# Altium project MY26 HV Inverter Logic Board.PrjPcb (part 1 of 3)
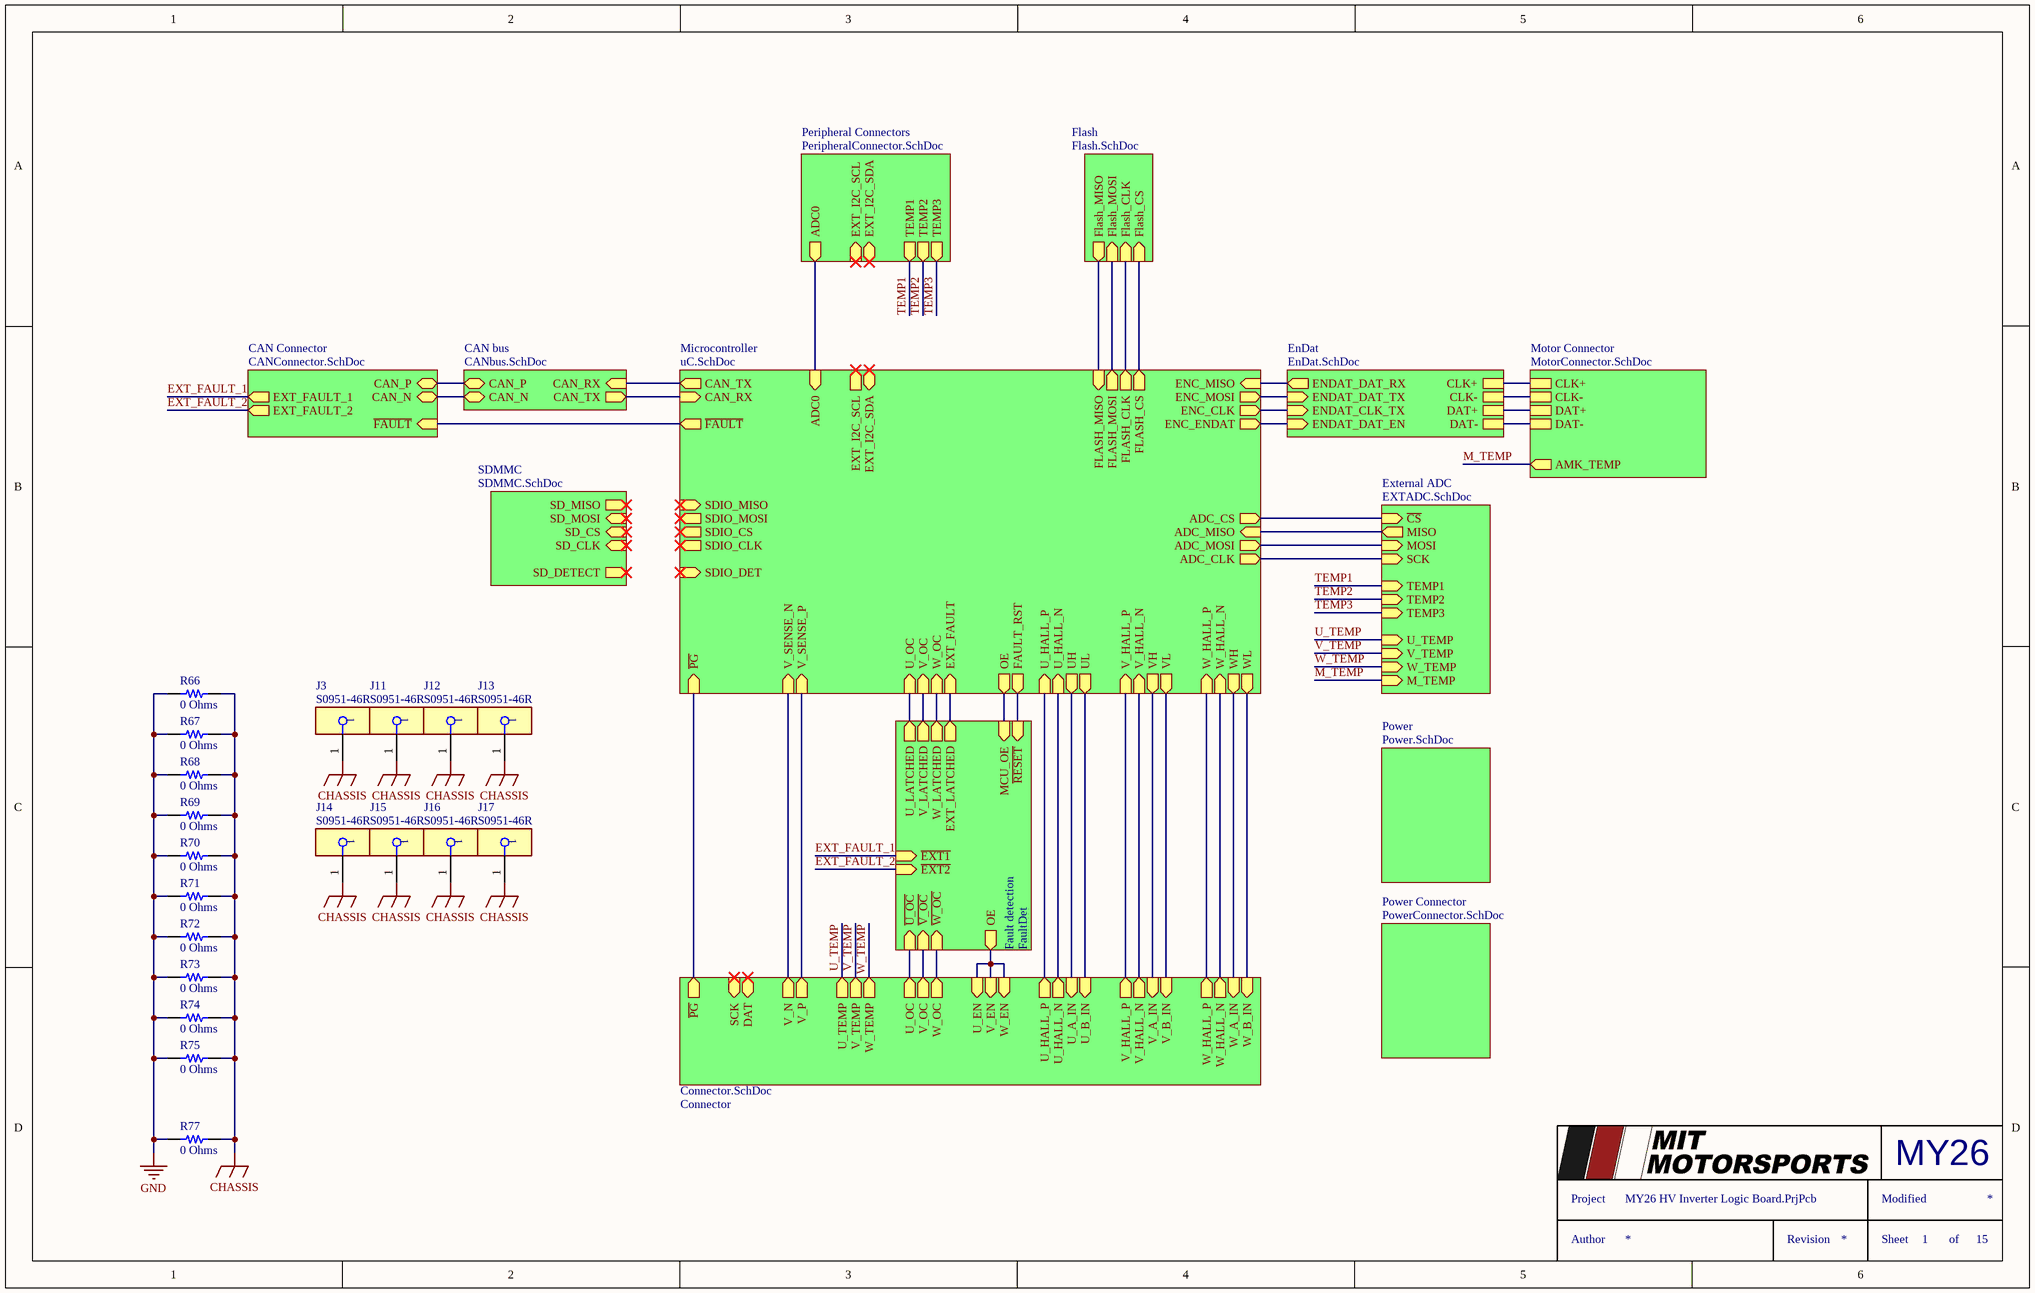
[diagram p0: Schematic.SchDoc]
Model: 26
15 sheets, 228 parts. Net scope: hierarchical (ports join the sheet entries above them; power ports are global).
Board file: PCB.PcbDoc
Sheets:
  Schematic.SchDoc
    CAN bus = CANbus.SchDoc
    Microcontroller = uC.SchDoc
      JTAG = JTAG.SchDoc
    Connector = Connector.SchDoc
    SDMMC = SDMMC.SchDoc
    Power = Power.SchDoc
    Power Connector = PowerConnector.SchDoc
    CAN Connector = CANConnector.SchDoc
    Motor Connector = MotorConnector.SchDoc
    Peripheral Connectors = PeripheralConnector.SchDoc
    External ADC = EXTADC.SchDoc
    EnDat = EnDat.SchDoc
    Fault detection = FaultDet.SchDoc
    Flash = Flash.SchDoc

## Sheet Schematic.SchDoc
size B; SheetNumber: 1; SheetTotal: 15

### Parts
(Parts that share a designator on the sheet are numbered #1, #2 ... from top to bottom, then left to right.)
J3#1  S0951-46R  [FP-S0951-46R-MFG]
J11  S0951-46R  [FP-S0951-46R-MFG]
J12  S0951-46R  [FP-S0951-46R-MFG]
J13  S0951-46R  [FP-S0951-46R-MFG]
J14  S0951-46R  [FP-S0951-46R-MFG]
J15  S0951-46R  [FP-S0951-46R-MFG]
J16  S0951-46R  [FP-S0951-46R-MFG]
J17  S0951-46R  [FP-S0951-46R-MFG]
R66  0 Ohms  [RES 0402_1005]
R67  0 Ohms  [RES 0402_1005]
R68  0 Ohms  [RES 0402_1005]
R69  0 Ohms  [RES 0402_1005]
R70  0 Ohms  [RES 0402_1005]
R71  0 Ohms  [RES 0402_1005]
R72  0 Ohms  [RES 0402_1005]
R73  0 Ohms  [RES 0402_1005]
R74  0 Ohms  [RES 0402_1005]
R75  0 Ohms  [RES 0402_1005]
R77  0 Ohms  [RES 0402_1005]

### Sub-sheets
CAN bus = CANbus.SchDoc: CAN_N (bidir), CAN_P (bidir), CAN_RX (in), CAN_TX (out)
CAN Connector = CANConnector.SchDoc: ~{FAULT} (in), CAN_P (bidir), CAN_N (bidir), EXT_FAULT_1 (out), EXT_FAULT_2 (out)
Connector = Connector.SchDoc: W_HALL_N (out), W_HALL_P (out), W_A_IN (in), W_B_IN (in), V_A_IN (in), V_B_IN (in), V_HALL_N (out), V_HALL_P (out), U_HALL_P (out), U_HALL_N (out), U_B_IN (in), U_A_IN (in), U_OC (out), V_OC (out), W_OC (out), U_TEMP (out), V_TEMP (out), W_TEMP (out), V_N (out), V_P (out), SCK (in), DAT (bidir), ~{PG} (out), U_EN (in), V_EN (in), W_EN (in)
EnDat = EnDat.SchDoc: ENDAT_DAT_RX (out), ENDAT_DAT_EN (in), ENDAT_DAT_TX (in), ENDAT_CLK_TX (in), CLK-, CLK+, DAT+, DAT-
External ADC = EXTADC.SchDoc: ~{CS} (in), MISO (out), MOSI (in), SCK (in), TEMP1 (in), TEMP2 (in), TEMP3 (in), U_TEMP (in), V_TEMP (in), W_TEMP (in), M_TEMP (in)
Fault detection = FaultDet: MCU_OE (in), OE (out), EXT_LATCHED (out), U_LATCHED (out), V_LATCHED (out), W_LATCHED (out), ~{W_OC} (in), ~{V_OC} (in), ~{U_OC} (in), ~{RESET} (in), ~{EXT1} (in), ~{EXT2} (in)
Flash = Flash.SchDoc: Flash_CS (in), Flash_MISO (out), Flash_CLK (in), Flash_MOSI (in)
Microcontroller = uC.SchDoc: CAN_TX (out), CAN_RX (in), ~{FAULT} (out), SDIO_MISO (in), SDIO_MOSI (out), SDIO_CS (out), SDIO_CLK (out), UH (out), UL (out), U_HALL_P (in), U_HALL_N (in), WH (out), WL (out), W_HALL_P (in), W_HALL_N (in), VH (out), VL (out), V_HALL_P (in), V_HALL_N (in), U_OC (in), V_OC (in), W_OC (in), V_SENSE_N (in), V_SENSE_P (in), ~{PG} (in), EXT_I2C_SCL (out), EXT_I2C_SDA (bidir), ADC_MOSI (out), ADC_MISO (in), ADC_CLK (out), ADC_CS (out), OE (out), ENC_MISO (in), ENC_MOSI (out), ENC_CLK (out), ENC_ENDAT (out), EXT_FAULT (in), FAULT_RST (out), SDIO_DET (in), FLASH_MISO (in), FLASH_MOSI (out), FLASH_CLK (out), FLASH_CS (out), ADC0 (in)
Motor Connector = MotorConnector.SchDoc: AMK_TEMP (out), CLK+, CLK-, DAT+, DAT-
Peripheral Connectors = PeripheralConnector.SchDoc: ADC0 (out), TEMP1 (out), TEMP2 (out), TEMP3 (out), EXT_I2C_SCL (in), EXT_I2C_SDA (bidir)
Power = Power.SchDoc: no entries
Power Connector = PowerConnector.SchDoc: no entries
SDMMC = SDMMC.SchDoc: SD_DETECT (out), SD_MISO (out), SD_CS (in), SD_MOSI (in), SD_CLK (in)

### Nets
CHASSIS: J3#1.1 J11.1 J12.1 J13.1 J14.1 J15.1 J16.1 J17.1 R66.2 R67.2 R68.2 R69.2 R70.2 R71.2 R72.2 R73.2 R74.2 R75.2 R77.2
GND: R66.1 R67.1 R68.1 R69.1 R70.1 R71.1 R72.1 R73.1 R74.1 R75.1 R77.1 ; sheet Connector/SCK, sheet Connector/DAT
ADC0: sheet Microcontroller/ADC0, sheet Peripheral Connectors/ADC0
ADC_CLK: sheet Microcontroller/ADC_CLK, sheet External ADC/SCK
ADC_CS: sheet Microcontroller/ADC_CS, sheet External ADC/~{CS}
ADC_MISO: sheet Microcontroller/ADC_MISO, sheet External ADC/MISO
ADC_MOSI: sheet Microcontroller/ADC_MOSI, sheet External ADC/MOSI
CAN_N: sheet CAN bus/CAN_N, sheet CAN Connector/CAN_N
CAN_P: sheet CAN bus/CAN_P, sheet CAN Connector/CAN_P
CAN_RX: sheet CAN bus/CAN_TX, sheet Microcontroller/CAN_RX
CAN_TX: sheet CAN bus/CAN_RX, sheet Microcontroller/CAN_TX
CLK+: sheet Motor Connector/CLK+, sheet EnDat/CLK+
CLK-: sheet Motor Connector/CLK-, sheet EnDat/CLK-
DAT+: sheet Motor Connector/DAT+, sheet EnDat/DAT+
DAT-: sheet Motor Connector/DAT-, sheet EnDat/DAT-
ENC_CLK: sheet Microcontroller/ENC_CLK, sheet EnDat/ENDAT_CLK_TX
ENC_ENDAT: sheet Microcontroller/ENC_ENDAT, sheet EnDat/ENDAT_DAT_EN
ENC_MISO: sheet Microcontroller/ENC_MISO, sheet EnDat/ENDAT_DAT_RX
ENC_MOSI: sheet Microcontroller/ENC_MOSI, sheet EnDat/ENDAT_DAT_TX
EXT_FAULT: sheet Microcontroller/EXT_FAULT, sheet Fault detection/EXT_LATCHED
EXT_FAULT_1: sheet CAN Connector/EXT_FAULT_1, sheet Fault detection/~{EXT1}
EXT_FAULT_2: sheet CAN Connector/EXT_FAULT_2, sheet Fault detection/~{EXT2}
~{FAULT}: sheet Microcontroller/~{FAULT}, sheet CAN Connector/~{FAULT}
FAULT_RST: sheet Microcontroller/FAULT_RST, sheet Fault detection/~{RESET}
FLASH_CLK: sheet Microcontroller/FLASH_CLK, sheet Flash/Flash_CLK
FLASH_CS: sheet Microcontroller/FLASH_CS, sheet Flash/Flash_CS
FLASH_MISO: sheet Microcontroller/FLASH_MISO, sheet Flash/Flash_MISO
FLASH_MOSI: sheet Microcontroller/FLASH_MOSI, sheet Flash/Flash_MOSI
M_TEMP: sheet Motor Connector/AMK_TEMP, sheet External ADC/M_TEMP
OE: sheet Microcontroller/OE, sheet Fault detection/MCU_OE
~{PG}: sheet Microcontroller/~{PG}, sheet Connector/~{PG}
TEMP1: sheet Peripheral Connectors/TEMP1, sheet External ADC/TEMP1
TEMP2: sheet Peripheral Connectors/TEMP2, sheet External ADC/TEMP2
TEMP3: sheet Peripheral Connectors/TEMP3, sheet External ADC/TEMP3
U_A_IN: sheet Microcontroller/UH, sheet Connector/U_A_IN
U_B_IN: sheet Microcontroller/UL, sheet Connector/U_B_IN
U_EN: sheet Connector/U_EN, sheet Connector/V_EN, sheet Connector/W_EN, sheet Fault detection/OE
U_HALL_N: sheet Microcontroller/U_HALL_N, sheet Connector/U_HALL_N
U_HALL_P: sheet Microcontroller/U_HALL_P, sheet Connector/U_HALL_P
U_LATCHED: sheet Microcontroller/U_OC, sheet Fault detection/U_LATCHED
U_OC: sheet Connector/U_OC, sheet Fault detection/~{U_OC}
U_TEMP: sheet Connector/U_TEMP, sheet External ADC/U_TEMP
V_A_IN: sheet Microcontroller/VH, sheet Connector/V_A_IN
V_B_IN: sheet Microcontroller/VL, sheet Connector/V_B_IN
V_HALL_N: sheet Microcontroller/V_HALL_N, sheet Connector/V_HALL_N
V_HALL_P: sheet Microcontroller/V_HALL_P, sheet Connector/V_HALL_P
V_LATCHED: sheet Microcontroller/V_OC, sheet Fault detection/V_LATCHED
V_OC: sheet Connector/V_OC, sheet Fault detection/~{V_OC}
V_SENSE_N: sheet Microcontroller/V_SENSE_N, sheet Connector/V_N
V_SENSE_P: sheet Microcontroller/V_SENSE_P, sheet Connector/V_P
V_TEMP: sheet Connector/V_TEMP, sheet External ADC/V_TEMP
W_A_IN: sheet Microcontroller/WH, sheet Connector/W_A_IN
W_B_IN: sheet Microcontroller/WL, sheet Connector/W_B_IN
W_HALL_N: sheet Microcontroller/W_HALL_N, sheet Connector/W_HALL_N
W_HALL_P: sheet Microcontroller/W_HALL_P, sheet Connector/W_HALL_P
W_LATCHED: sheet Microcontroller/W_OC, sheet Fault detection/W_LATCHED
W_OC: sheet Connector/W_OC, sheet Fault detection/~{W_OC}
W_TEMP: sheet Connector/W_TEMP, sheet External ADC/W_TEMP

### Notes on the sheet
- MY
- Project
- Author
- Revision
- Sheet
- Modified
- of

### Library data of the parts
J3#1 J11-J17 = CMP-15817-000012-1: RFI SHIELD CLIP MINI TIN SMD; Width: 0.04inch; Min Operating Temperature: -40°C; Max Operating Temperature: 185°C; Thickness: 0.051inch; REACH SVHC: No SVHC; Length: 0.155inch
R66-R75 R77 = RCC04020000Z0ED: RCC0402 0R0 ET7 E3; Manufacturer: Vishay Dale; Power (Watts): 0.125W, 1/8W; Tolerance: Jumper; Part Number: RCC04020000Z0ED; Value: 0 Ohms; ComponentLink1Description: Datasheet; ComponentLink1URL: https://www.vishay.com/docs/20066/rcce3.pdf; ComponentLink2Description: DigiKey Link; ComponentLink2URL: https://www.digikey.com/en/products/detail/vishay-dale/RCC04020000Z0ED/12084253; Composition: Thick Film; Device Package: 0402 (1005 Metric); Features: Automotive AEC-Q200; Height - Seated (Max): 0.016" (0.40mm); LastUpdated: 2/9/2024 8:28:54 PM; Lifecycle Status: Active; Minimum Order: 1; Number of Terminations: 2; Operating Temperature: -55°C ~ 155°C; Package / Case: 0402 (1005 Metric); Packaging: TapeAndReel; PartId: 66958; Part Status: Active; Price: 0.01; Ratings: AEC-Q200; Resistance: 0 Ohms; Series: RCC e3; Size / Dimension: 0.039" L x 0.020" W (1.00mm x 0.50mm); Supplier 1: DigiKey; Supplier Part Number 1: 541-RCC04020000Z0EDCT-ND; Supplier Device Package: 0402

## Sheet CANbus.SchDoc
size A; SheetNumber: 3; SheetTotal: 15
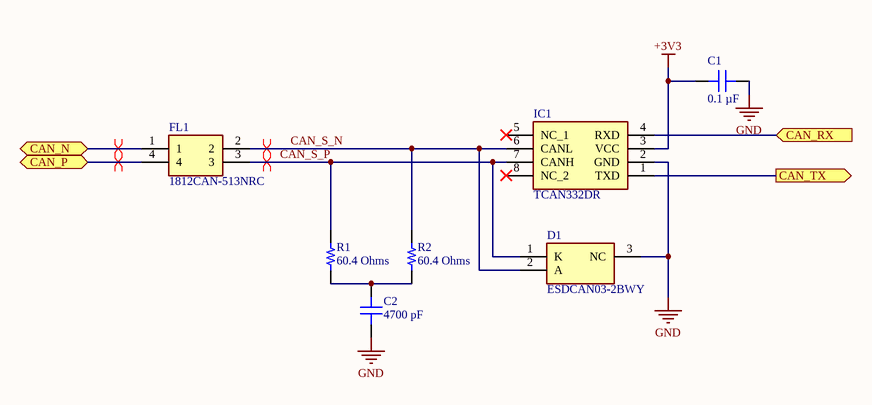
[diagram p1: CANbus.SchDoc]

### Parts
C1  0.1 µF  [CAP 0402_1005]
C2  4700 pF  [CAP 0402_1005]
D1  ESDCAN03-2BWY  [SOT65P210X110-3N]
FL1  1812CAN-513NRC  [1812CAN513NRC]
IC1  TCAN332DR  [SOIC127P600X175-8N]
R1  60.4 Ohms  [RES 0402_1005]
R2  60.4 Ohms  [RES 0402_1005]

### Ports
CAN_N (bidir), CAN_P (bidir), CAN_RX (in), CAN_TX (out)

### Nets
+3V3: C1.1 IC1.3(VCC)
GND: C1.2 C2.1 D1.3(NC) IC1.2(GND)
CAN_N: FL1.1 ; port CAN_N
CAN_P: FL1.4 ; port CAN_P
CAN_RX: IC1.1(TXD) ; port CAN_TX
CAN_S_N: D1.2(A) FL1.2 IC1.6(CANL) R2.1  [project net CAN_S_N_3]
CAN_S_P: D1.1(K) FL1.3 IC1.7(CANH) R1.1  [project net CAN_S_P_3]
CAN_TX: IC1.4(RXD) ; port CAN_RX
NetC2_2: C2.2 R1.2 R2.2

Not connected (* = marked no-connect by the designer): IC1 5(NC_1)* 8(NC_2)*

### Layout directives
differential pair: CAN_N, CAN_P, CAN_S_N_3, CAN_S_P_3

### Library data of the parts
C1 = C0402C104K4RECAUTO: CAP CER 0402 0.1UF 16V X7R 10%; manufacturer: KEMET; Part Number: C0402C104K4RECAUTO; Capacitance: 0.1 µF; Applications: Automotive, ESD Protection; componentlink1description: Datasheet; componentlink1url: https://api.kemet.com/component-edge/download/datasheet/C0402C104K4RECAUTO.pdf; componentlink2description: DigiKey Link; componentlink2url: https://www.digikey.com/en/products/detail/kemet/C0402C104K4RECAUTO/8563695; Device Package: 0402 (1005 Metric); lastupdated: 2/9/2024 8:04:38 PM; Lifecycle Status: Active; Minimum Order: 1; Mounting Type: Surface Mount, MLCC; Operating Temperature: -55°C ~ 125°C; Package / Case: 0402 (1005 Metric); packaging: TapeAndReel; partid: 1731; Part Status: Active; price: 0.01; Ratings: AEC-Q200; series: ESD SMD Auto X7R; Size / Dimension: 0.039" L x 0.020" W (1.00mm x 0.50mm); Supplier 1: DigiKey; Supplier Part Number 1: 399-17167-1-ND; Temperature Coefficient: X7R; Thickness (Max): 0.022" (0.55mm); Tolerance: ±10%; value: 0.1 µF; Voltage - Rated: 16V
C2 = C0402C472K4RECAUTO: CAP CER 0402 4.7NF 16V X7R 10%; manufacturer: KEMET; Part Number: C0402C472K4RECAUTO; Capacitance: 4700 pF; Applications: Automotive, ESD Protection; componentlink1description: Datasheet; componentlink1url: https://api.kemet.com/component-edge/download/datasheet/C0402C472K4RECAUTO.pdf; componentlink2description: DigiKey Link; componentlink2url: https://www.digikey.com/en/products/detail/kemet/C0402C472K4RECAUTO/8640469; Device Package: 0402 (1005 Metric); lastupdated: 2/9/2024 8:04:21 PM; Lifecycle Status: Active; Minimum Order: 1; Mounting Type: Surface Mount, MLCC; Operating Temperature: -55°C ~ 125°C; Package / Case: 0402 (1005 Metric); packaging: TapeAndReel; partid: 12122; Part Status: Active; price: 0.01; Ratings: AEC-Q200; series: ESD SMD Auto X7R; Size / Dimension: 0.039" L x 0.020" W (1.00mm x 0.50mm); Supplier 1: DigiKey; Supplier Part Number 1: 399-17875-1-ND; Temperature Coefficient: X7R; Thickness (Max): 0.022" (0.55mm); Tolerance: ±10%; value: 4700 pF; Voltage - Rated: 16V
D1 = ESDCAN03-2BWY: TVS Diode (Uni-directional); Manufacturer_Name: STMicroelectronics; Datasheet Link: https://www.mouser.de/datasheet/2/389/esdcan02-2bwy-954689.pdf; Height: 1.1mm; Manufacturer_Part_Number: ESDCAN03-2BWY; Mouser Part Number: 511-ESDCAN03-2BWY; Mouser Price/Stock: https://www.mouser.co.uk/ProductDetail/STMicroelectronics/ESDCAN03-2BWY?qs=FqY30PPN9V2iiokjuqa22Q%3D%3D; Arrow Part Number: ESDCAN03-2BWY; Arrow Price/Stock: https://www.arrow.com/en/products/esdcan03-2bwy/stmicroelectronics?region=nac
FL1 = 1812CAN-513NRC: Filter; Manufacturer_Name: COILCRAFT; Datasheet Link: https://www.coilcraft.com/getmedia/07970769-ca48-411d-9c96-6ae867bbb31e/1812can.pdf; Height: 3mm; Manufacturer_Part_Number: 1812CAN-513NRC; Mouser Part Number: 994-1812CAN-513NRC; Mouser Price/Stock: https://www.mouser.co.uk/ProductDetail/Coilcraft/1812CAN-513NRC?qs=wnTfsH77Xs4YqxEo%2FcWzJA%3D%3D
IC1 = TCAN332DR: Integrated Circuit; Manufacturer_Name: Texas Instruments; Datasheet Link: http://www.ti.com/lit/ds/symlink/tcan332.pdf; Height: 1.75mm; Manufacturer_Part_Number: TCAN332DR; Mouser Part Number: 595-TCAN332DR; Mouser Price/Stock: https://www.mouser.co.uk/ProductDetail/Texas-Instruments/TCAN332DR?qs=n%252BTO0c4TDSYIUeM9WmVMtA%3D%3D; Arrow Part Number: TCAN332DR; Arrow Price/Stock: https://www.arrow.com/en/products/tcan332dr/texas-instruments?region=nac
R1 R2 = CRCW040260R4FKED: RES SMD 60.4 OHM 1% 1/16W 0402; Manufacturer: Vishay Dale; Power (Watts): 0.063W, 1/16W; Temperature Coefficient: ±100ppm/°C; Part Number: CRCW040260R4FKED; Value: 60.4 Ohms; ComponentLink1Description: Datasheet; ComponentLink1URL: http://www.vishay.com/docs/20035/dcrcwe3.pdf; ComponentLink2Description: DigiKey Link; ComponentLink2URL: https://www.digikey.com/en/products/detail/vishay-dale/CRCW040260R4FKED/1177868; Composition: Thick Film; Device Package: 0402 (1005 Metric); Features: Automotive AEC-Q200; Height - Seated (Max): 0.016" (0.40mm); LastUpdated: 2/9/2024 8:29:54 PM; Lifecycle Status: Active; Minimum Order: 1; Number of Terminations: 2; Operating Temperature: -55°C ~ 155°C; Package / Case: 0402 (1005 Metric); Packaging: TapeAndReel; PartId: 10502; Part Status: Active; Price: 0.01; Ratings: AEC-Q200; Resistance: 60.4 Ohms; Series: CRCW; Size / Dimension: 0.039" L x 0.020" W (1.00mm x 0.50mm); Supplier 1: DigiKey; Supplier Part Number 1: 541-60.4LCT-ND; Supplier Device Package: 0402; Tolerance: ±1%

## Sheet uC.SchDoc
size OrCAD B; SheetNumber: 4; SheetTotal: 15
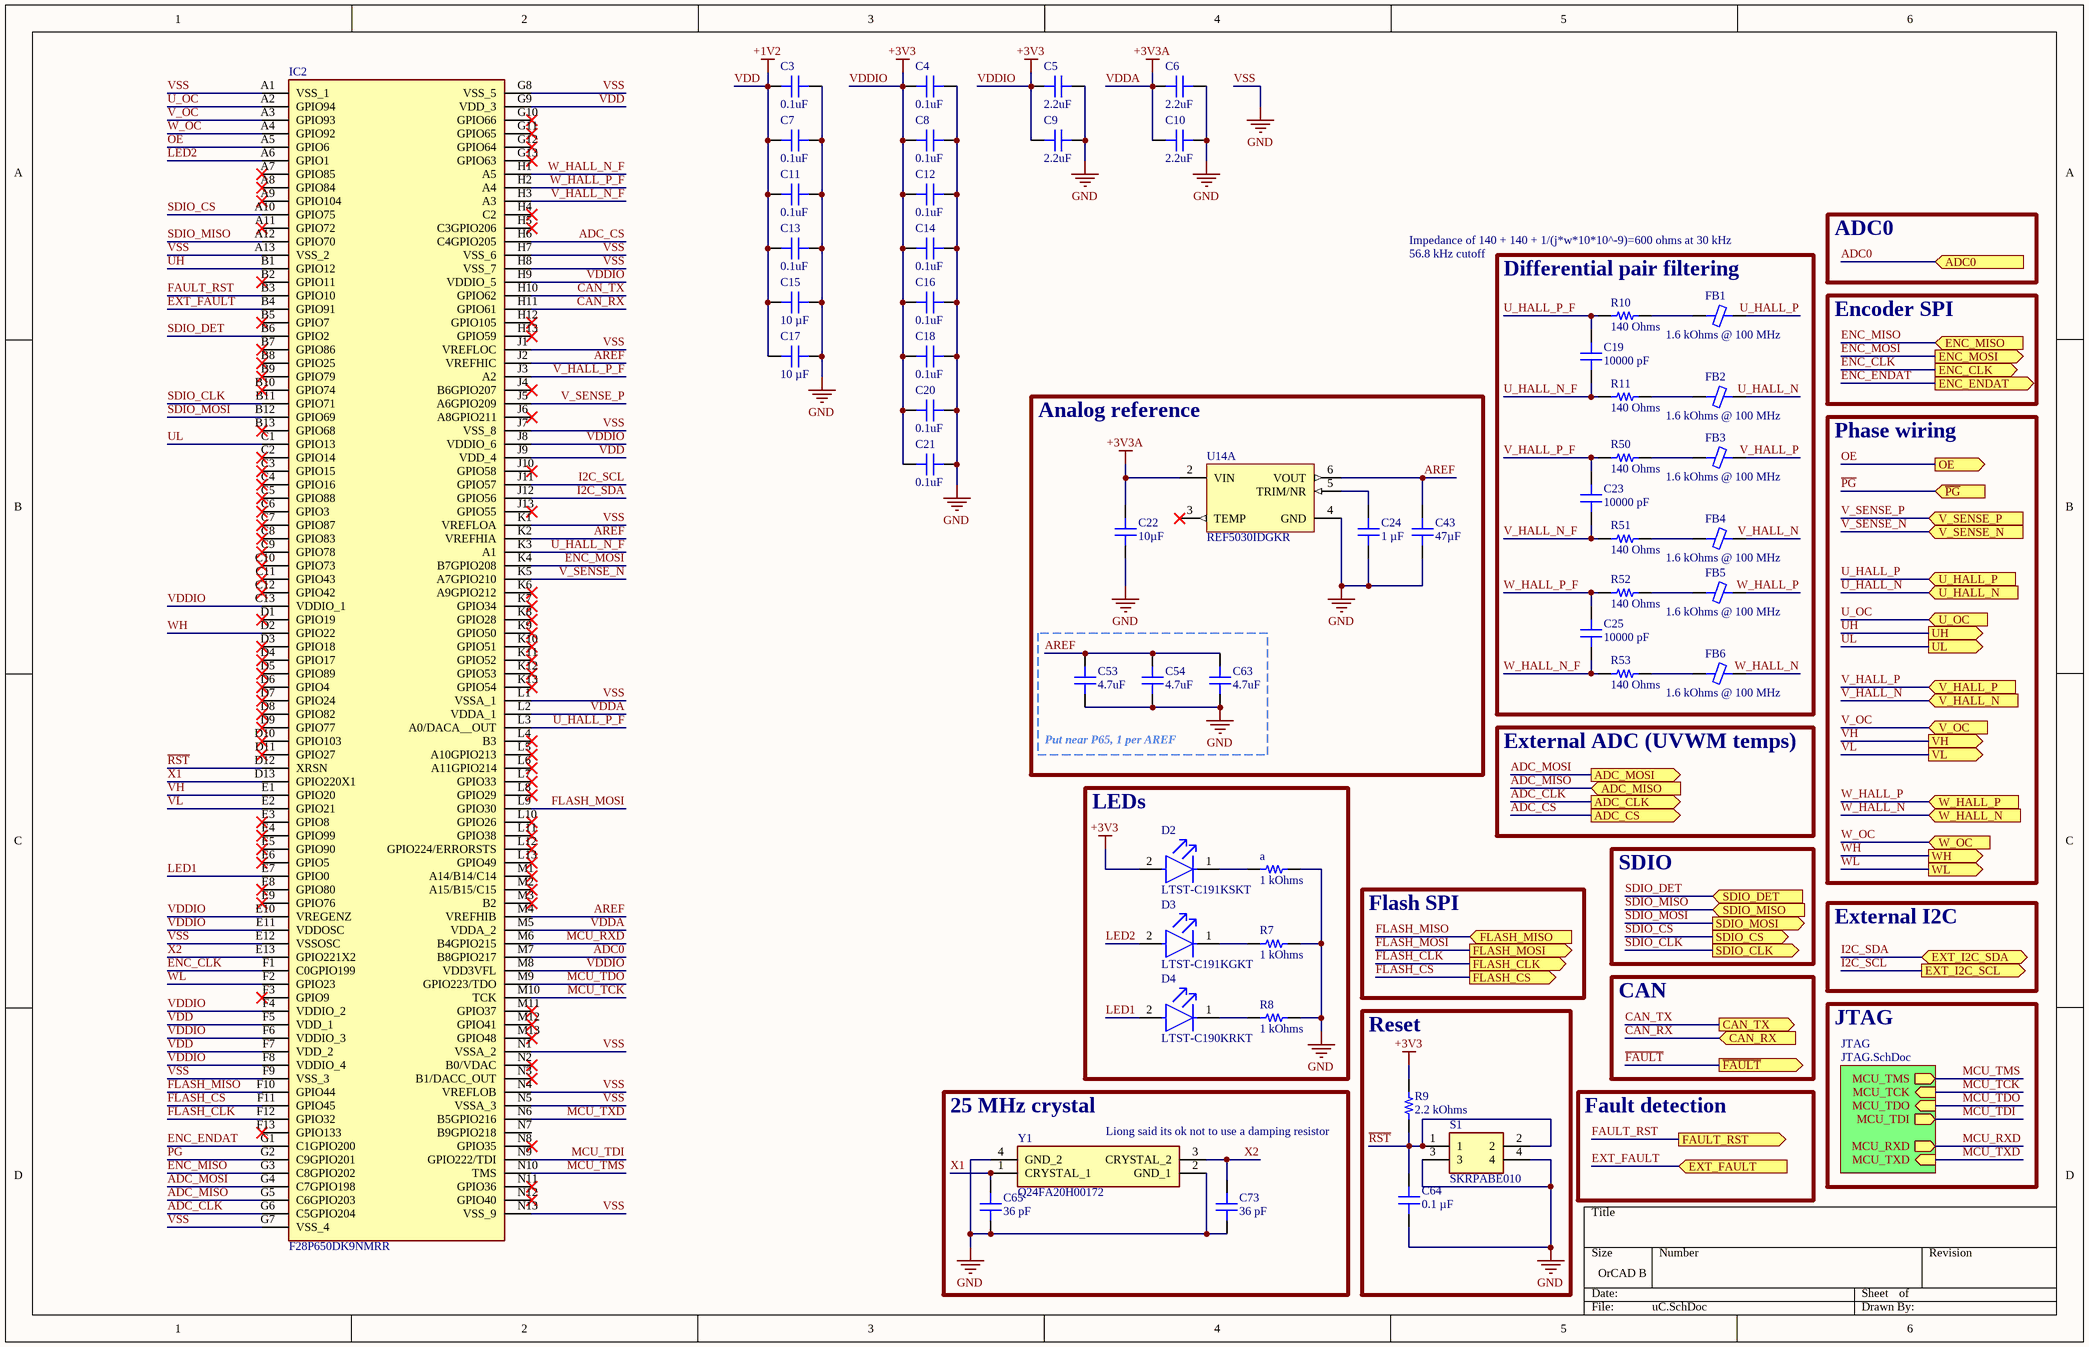
[diagram p2: uC.SchDoc]

### Parts
(Parts that share a designator on the sheet are numbered #1, #2 ... from top to bottom, then left to right.)
a  1 kOhms  [YAGEO RES 0402_1005]
C3  0.1uF  [0µF 0201-Footprint-1]
C4  0.1uF  [0µF 0201-Footprint-1]
C5  2.2uF  [0µF 0201-Footprint-1]
C6  2.2uF  [0µF 0201-Footprint-1]
C7  0.1uF  [0µF 0201-Footprint-1]
C8  0.1uF  [0µF 0201-Footprint-1]
C9  2.2uF  [0µF 0201-Footprint-1]
C10  2.2uF  [0µF 0201-Footprint-1]
C11  0.1uF  [0µF 0201-Footprint-1]
C12  0.1uF  [0µF 0201-Footprint-1]
C13  0.1uF  [0µF 0201-Footprint-1]
C14  0.1uF  [0µF 0201-Footprint-1]
C15  10 µF  [CAP 0402_1005]
C16  0.1uF  [0µF 0201-Footprint-1]
C17  10 µF  [CAP 0402_1005]
C18  0.1uF  [0µF 0201-Footprint-1]
C19  10000 pF  [CAP 0402_1005]
C20  0.1uF  [0µF 0201-Footprint-1]
C21  0.1uF  [0µF 0201-Footprint-1]
C22  10µF  [CAP 0402_1005]
C23  10000 pF  [CAP 0402_1005]
C24  1 µF  [CAP 0402_1005]
C25#1  10000 pF  [CAP 0402_1005]
C43  47µF  [CAP 0603_1608]
C53  4.7uF  [0µF 0201-Footprint-1]
C54  4.7uF  [0µF 0201-Footprint-1]
C63  4.7uF  [0µF 0201-Footprint-1]
C64  0.1 µF  [CAP 0402_1005]
C65  36 pF  [CAP 0402_1005]
C73  36 pF  [CAP 0402_1005]
D2  LTST-C191KSKT  [FP-LTST-C191KSKT-MFG]
D3  LTST-C191KGKT  [FP-LTST-C191KGKT-MFG]
D4  LTST-C190KRKT  [FP-LTST-C190KRKT-MFG]
FB1  1.6 kOhms @ 100 MHz  [FER 0603_1608]
FB2  1.6 kOhms @ 100 MHz  [FER 0603_1608]
FB3  1.6 kOhms @ 100 MHz  [FER 0603_1608]
FB4  1.6 kOhms @ 100 MHz  [FER 0603_1608]
FB5  1.6 kOhms @ 100 MHz  [FER 0603_1608]
FB6  1.6 kOhms @ 100 MHz  [FER 0603_1608]
IC2  F28P650DK9NMRR  [BGA169C65P13X13_900X900X100]
R7  1 kOhms  [YAGEO RES 0402_1005]
R8  1 kOhms  [YAGEO RES 0402_1005]
R9  2.2 kOhms  [RES 0402_1005]
R10  140 Ohms  [RES 0402_1005]
R11  140 Ohms  [RES 0402_1005]
R50  140 Ohms  [RES 0402_1005]
R51  140 Ohms  [RES 0402_1005]
R52  140 Ohms  [RES 0402_1005]
R53  140 Ohms  [RES 0402_1005]
S1  SKRPABE010  [SKRPABE010]
U14  REF5030IDGKR  [DGK0008A_L]  (part A of 2)
Y1  Q24FA20H00172  [FA20H160000MF12ZAC3]

### Blocks framed on the sheet
Differential pair filtering: C19 C23 C25#1 FB1-FB6 R10 R11 R50-R53
Analog reference: C22 C24 C43 U14
Put near P65, 1 per AREF: C53 C54 C63
LEDs: a D2-D4 R7 R8
Reset: C64 R9 S1
25 MHz crystal: C65 C73 Y1

### Sub-sheets
JTAG = JTAG.SchDoc: MCU_TMS (out), MCU_TCK (in), MCU_TDO (in), MCU_TDI (out), MCU_RXD (out), MCU_TXD (in)

### Ports
ADC0 (in), ADC_CLK (out), ADC_CS (out), ADC_MISO (in), ADC_MOSI (out), CAN_RX (in), CAN_TX (out), ENC_CLK (out), ENC_ENDAT (out), ENC_MISO (in), ENC_MOSI (out), EXT_FAULT (in), EXT_I2C_SCL (out), EXT_I2C_SDA (bidir), FAULT_RST (out), FLASH_CLK (out), FLASH_CS (out), FLASH_MISO (in), FLASH_MOSI (out), OE (out), SDIO_CLK (out), SDIO_CS (out), SDIO_DET (in), SDIO_MISO (in), SDIO_MOSI (out), U_HALL_N (in), U_HALL_P (in), U_OC (in), UH (out), UL (out), V_HALL_N (in), V_HALL_P (in), V_OC (in), V_SENSE_N (in), V_SENSE_P (in), VH (out), VL (out), W_HALL_N (in), W_HALL_P (in), W_OC (in), WH (out), WL (out), ~{FAULT} (out), ~{PG} (in)

### Nets
+1V2: C3.1 C7.1 C11.1 C13.1 C15.1 C17.1 IC2.F5(VDD_1) IC2.F7(VDD_2) IC2.G9(VDD_3) IC2.J9(VDD_4)  [also labelled VDD]
+3V3: C4.1 C5.1 C8.1 C9.1 C12.1 C14.1 C16.1 C18.1 C20.1 C21.1 D2.2(A) IC2.C13(VDDIO_1) IC2.E10(VREGENZ) IC2.E11(VDDOSC) IC2.F4(VDDIO_2) IC2.F6(VDDIO_3) IC2.F8(VDDIO_4) IC2.H9(VDDIO_5) IC2.J8(VDDIO_6) IC2.M8(VDD3VFL) R9.2  [also labelled VDDIO]
+3V3A: C6.1 C10.1 C22.2 IC2.L2(VDDA_1) IC2.M5(VDDA_2) U14.2(VIN)  [also labelled VDDA]
GND: a.2 C3.2 C4.2 C5.2 C6.2 C7.2 C8.2 C9.2 C10.2 C11.2 C12.2 C13.2 C14.2 C15.2 C16.2 C17.2 C18.2 C20.2 C21.2 C22.1 C24.1 C43.1 C53.1 C54.1 C63.1 C64.1 C65.1 C73.1 IC2.A1(VSS_1) IC2.A13(VSS_2) IC2.E12(VSSOSC) IC2.F9(VSS_3) IC2.G7(VSS_4) IC2.G8(VSS_5) IC2.H7(VSS_6) IC2.H8(VSS_7) IC2.J1(VREFLOC) IC2.J7(VSS_8) IC2.K1(VREFLOA) IC2.L1(VSSA_1) IC2.N1(VSSA_2) IC2.N4(VREFLOB) IC2.N5(VSSA_3) IC2.N13(VSS_9) R7.2 R8.2 S1.3 S1.4 U14.4(GND) Y1.2(GND_1) Y1.4(GND_2)  [also labelled VSS]
ADC0: IC2.M7(B8GPIO217) ; port ADC0
ADC_CLK: IC2.G6(C5GPIO204) ; port ADC_CLK
ADC_CS: IC2.H6(C4GPIO205) ; port ADC_CS
ADC_MISO: IC2.G5(C6GPIO203) ; port ADC_MISO
ADC_MOSI: IC2.G4(C7GPIO198) ; port ADC_MOSI
AREF: C43.2 C53.2 C54.2 C63.2 IC2.J2(VREFHIC) IC2.K2(VREFHIA) IC2.M4(VREFHIB) U14.6(VOUT)  [project net AREF_4]
CAN_RX: IC2.H11(GPIO61) ; port CAN_RX
CAN_TX: IC2.H10(GPIO62) ; port CAN_TX
ENC_CLK: IC2.F1(C0GPIO199) ; port ENC_CLK
ENC_ENDAT: IC2.G1(C1GPIO200) ; port ENC_ENDAT
ENC_MISO: IC2.G3(C8GPIO202) ; port ENC_MISO
ENC_MOSI: IC2.K4(B7GPIO208) ; port ENC_MOSI
EXT_FAULT: IC2.B4(GPIO91) ; port EXT_FAULT
FAULT_RST: IC2.B3(GPIO10) ; port FAULT_RST
FLASH_CLK: IC2.F12(GPIO32) ; port FLASH_CLK
FLASH_CS: IC2.F11(GPIO45) ; port FLASH_CS
FLASH_MISO: IC2.F10(GPIO44) ; port FLASH_MISO
FLASH_MOSI: IC2.L9(GPIO30) ; port FLASH_MOSI
I2C_SCL: IC2.J11(GPIO57) ; port EXT_I2C_SCL
I2C_SDA: IC2.J12(GPIO56) ; port EXT_I2C_SDA
LED1: D4.2(A) IC2.E7(GPIO0)  [project net LED1_4]
LED2: D3.2(A) IC2.A6(GPIO1)  [project net LED2_4]
MCU_RXD: IC2.M6(B4GPIO215) ; sheet JTAG/MCU_RXD
MCU_TCK: IC2.M10(TCK) ; sheet JTAG/MCU_TCK
MCU_TDI: IC2.N9(GPIO222/TDI) ; sheet JTAG/MCU_TDI
MCU_TDO: IC2.M9(GPIO223/TDO) ; sheet JTAG/MCU_TDO
MCU_TMS: IC2.N10(TMS) ; sheet JTAG/MCU_TMS
MCU_TXD: IC2.N6(B5GPIO216) ; sheet JTAG/MCU_TXD
OE: IC2.A5(GPIO6) ; port OE
~{PG}: IC2.G2(C9GPIO201) ; port ~{PG}
~{RST}: C64.2 IC2.D12(XRSN) R9.1 S1.1 S1.2  [project net ~{RST}_4]
SDIO_CLK: IC2.B11(GPIO71) ; port SDIO_CLK
SDIO_CS: IC2.A10(GPIO75) ; port SDIO_CS
SDIO_DET: IC2.B6(GPIO2) ; port SDIO_DET
SDIO_MISO: IC2.A12(GPIO70) ; port SDIO_MISO
SDIO_MOSI: IC2.B12(GPIO69) ; port SDIO_MOSI
U_HALL_N: FB2.2 ; port U_HALL_N
U_HALL_N_F: C19.1 IC2.K3(A1) R11.1  [project net U_HALL_N_F_4]
U_HALL_P: FB1.2 ; port U_HALL_P
U_HALL_P_F: C19.2 IC2.L3(A0/DACA__OUT) R10.1  [project net U_HALL_P_F_4]
U_OC: IC2.A2(GPIO94) ; port U_OC  [project net U_LATCHED]
UH: IC2.B1(GPIO12) ; port UH  [project net U_A_IN]
UL: IC2.C1(GPIO13) ; port UL  [project net U_B_IN]
V_HALL_N: FB4.2 ; port V_HALL_N
V_HALL_N_F: C23.1 IC2.H3(A3) R51.1  [project net V_HALL_N_F_4]
V_HALL_P: FB3.2 ; port V_HALL_P
V_HALL_P_F: C23.2 IC2.J3(A2) R50.1  [project net V_HALL_P_F_4]
V_OC: IC2.A3(GPIO93) ; port V_OC  [project net V_LATCHED]
V_SENSE_N: IC2.K5(A7GPIO210) ; port V_SENSE_N
V_SENSE_P: IC2.J5(A6GPIO209) ; port V_SENSE_P
VH: IC2.E1(GPIO20) ; port VH  [project net V_A_IN]
VL: IC2.E2(GPIO21) ; port VL  [project net V_B_IN]
W_HALL_N: FB6.2 ; port W_HALL_N
W_HALL_N_F: C25#1.1 IC2.H1(A5) R53.1  [project net W_HALL_N_F_4]
W_HALL_P: FB5.2 ; port W_HALL_P
W_HALL_P_F: C25#1.2 IC2.H2(A4) R52.1  [project net W_HALL_P_F_4]
W_OC: IC2.A4(GPIO92) ; port W_OC  [project net W_LATCHED]
WH: IC2.D2(GPIO22) ; port WH  [project net W_A_IN]
WL: IC2.F2(GPIO23) ; port WL  [project net W_B_IN]
X1: C65.2 IC2.D13(GPIO220X1) Y1.1(CRYSTAL_1)  [project net X1_4]
X2: C73.2 IC2.E13(GPIO221X2) Y1.3(CRYSTAL_2)  [project net X2_4]
Neta_1: a.1 D2.1(C)
NetC24_2: C24.2 U14.5(TRIM/NR)
NetD3_1: D3.1(C) R7.1
NetD4_1: D4.1(C) R8.1
NetFB1_1: FB1.1 R10.2
NetFB2_1: FB2.1 R11.2
NetFB3_1: FB3.1 R50.2
NetFB4_1: FB4.1 R51.2
NetFB5_1: FB5.1 R52.2
NetFB6_1: FB6.1 R53.2

Not connected (* = marked no-connect by the designer): IC2 A7(GPIO85)* A8(GPIO84)* A9(GPIO104)* A11(GPIO72)* B2(GPIO11)* B5(GPIO7)* B7(GPIO86)* B8(GPIO25)* B9(GPIO79)* B10(GPIO74)* B13(GPIO68)* C2(GPIO14)* C3(GPIO15)* C4(GPIO16)* C5(GPIO88)* C6(GPIO3)* C7(GPIO87)* C8(GPIO83)* C9(GPIO78)* C10(GPIO73)* C11(GPIO43)* C12(GPIO42)* D1(GPIO19)* D3(GPIO18)* D4(GPIO17)* D5(GPIO89)* D6(GPIO4)* D7(GPIO24)* D8(GPIO82)* D9(GPIO77)* D10(GPIO103)* D11(GPIO27)* E3(GPIO8)* E4(GPIO99)* E5(GPIO90)* E6(GPIO5)* E8(GPIO80)* E9(GPIO76)* F3(GPIO9)* F13(GPIO133)* G10(GPIO66)* G11(GPIO65)* G12(GPIO64)* G13(GPIO63)* H4(C2)* H5(C3GPIO206)* H12(GPIO105)* H13(GPIO59)* J4(B6GPIO207)* J6(A8GPIO211)* J10(GPIO58)* J13(GPIO55)* K6(A9GPIO212)* K7(GPIO34)* K8(GPIO28)* K9(GPIO50)* K10(GPIO51)* K11(GPIO52)* K12(GPIO53)* K13(GPIO54)* L4(B3)* L5(A10GPIO213)* L6(A11GPIO214)* L7(GPIO33)* L8(GPIO29)* L10(GPIO26)* L11(GPIO38)* L12(GPIO224/ERRORSTS)* L13(GPIO49)* M1(A14/B14/C14)* M2(A15/B15/C15)* M3(B2)* M11(GPIO37)* M12(GPIO41)* M13(GPIO48)* N2(B0/VDAC)* N3(B1/DACC_OUT)* N7(B9GPIO218) N8(GPIO35)* N11(GPIO36)* N12(GPIO40)*; U14 3(TEMP)*

### Notes on the sheet
- 56.8 kHz cutoff
- Impedance of 140 + 140 + 1/(j*w*10*10^-9)=600 ohms at 30 kHz
- ADC0
- Encoder SPI
- Phase wiring
- External ADC (UVWM temps)
- SDIO
- Flash SPI
- External I2C
- CAN
- JTAG
- Liong said its ok not to use a damping resistor
- Fault detection

### Library data of the parts
a R7 R8 = RC0402JR-071KL: RES 1K OHM 5% 1/16W 0402; Manufacturer: Yageo; Power (Watts): 0.063W, 1/16W; Temperature Coefficient: ±100ppm/°C; Part Number: RC0402JR-071KL; Value: 1 kOhms; ComponentLink1Description: Datasheet; ComponentLink1URL: https://www.yageo.com/upload/media/product/productsearch/datasheet/rchip/PYu-RC_Group_51_RoHS_L_10.pdf; ComponentLink2Description: DigiKey Link; ComponentLink2URL: https://www.digikey.com/en/products/detail/yageo/RC0402JR-071KL/726408; Composition: Thick Film; Device Package: 0402 (1005 Metric); Features: Moisture Resistant; Height - Seated (Max): 0.016" (0.40mm); LastUpdated: 8/31/2025 3:03:59 PM; Lifecycle Status: Active; Minimum Order: 1; Number of Terminations: 2; Operating Temperature: -55°C ~ 155°C; Package / Case: 0402 (1005 Metric); Packaging: CutTape; PartId: 20532; Part Status: Active; Price: 0.01; Resistance: 1 kOhms; Series: RC_L; Size / Dimension: 0.039" L x 0.020" W (1.00mm x 0.50mm); Supplier 1: DigiKey; Supplier Part Number 1: 311-1.0KJRCT-ND; Supplier Device Package: 0402; Tolerance: ±5%
C3 C4 C7 C8 C11-C14 C16 C18 C20 C21 = CMP-714-000035-1: CAP CER 0.1UF 16V X5R 0201; ComponentLink2Description: DigiKey Link; ComponentLink1Description: Datasheet
C5 C6 C9 C10 = CMP-714-000035-1: CAP CER 2.2UF; ComponentLink2Description: DigiKey Link; ComponentLink1Description: Datasheet
C15 C17 = CL05A106MP8NUB8: CAP CER 10UF 10V X5R 0402; manufacturer: Samsung Electro-Mechanics; Tolerance: ±20%; Part Number: CL05A106MP8NUB8; Capacitance: 10 µF; Applications: Acoustic Noise Reduction; componentlink1description: Datasheet; componentlink1url: http://www.samsungsem.com/kr/support/product-search/mlcc/CL05A106MP8NUB8.jsp; componentlink2description: DigiKey Link; componentlink2url: https://www.digikey.com/en/products/detail/samsung-electro-mechanics/CL05A106MP8NUB8/5961314; Device Package: 0402 (1005 Metric); lastupdated: 2/9/2024 8:04:38 PM; Lifecycle Status: Active; Minimum Order: 1; Mounting Type: Surface Mount, MLCC; Operating Temperature: -55°C ~ 85°C; Package / Case: 0402 (1005 Metric); packaging: TapeAndReel; partid: 1758; Part Status: Active; price: 0.06; series: CL; Size / Dimension: 0.039" L x 0.020" W (1.00mm x 0.50mm); Supplier 1: DigiKey; Supplier Part Number 1: 1276-6830-1-ND; Temperature Coefficient: X5R; Thickness (Max): 0.035" (0.90mm); value: 10 µF; Voltage - Rated: 10V
C19 C23 C25#1 = C0402C103J5RECAUTO: CAP CER 0402 10NF 50V X7R 5%; manufacturer: KEMET; Part Number: C0402C103J5RECAUTO; Capacitance: 10000 pF; Applications: Automotive, ESD Protection; componentlink1description: Datasheet; componentlink1url: https://api.kemet.com/component-edge/download/datasheet/C0402C103J5RECAUTO.pdf; componentlink2description: DigiKey Link; componentlink2url: https://www.digikey.com/en/products/detail/kemet/C0402C103J5RECAUTO/8646448; Device Package: 0402 (1005 Metric); lastupdated: 2/9/2024 8:04:13 PM; Lifecycle Status: Active; Minimum Order: 1; Mounting Type: Surface Mount, MLCC; Operating Temperature: -55°C ~ 125°C; Package / Case: 0402 (1005 Metric); packaging: TapeAndReel; partid: 33153; Part Status: Active; price: 0.02; Ratings: AEC-Q200; series: ESD SMD Auto X7R; Size / Dimension: 0.039" L x 0.020" W (1.00mm x 0.50mm); Supplier 1: DigiKey; Supplier Part Number 1: 399-C0402C103J5RECAUTOCT-ND; Temperature Coefficient: X7R; Thickness (Max): 0.022" (0.55mm); Tolerance: ±5%; value: 10000 pF; Voltage - Rated: 50V
C22 = 0402ZD106MAT2A: CAP CER 10UF 10V X5R 0402; manufacturer: AVX Corporation; Tolerance: ±20%; Part Number: 0402ZD106MAT2A; Capacitance: 10µF; Applications: General Purpose; componentlink1description: Datasheet; componentlink1url: http://datasheets.avx.com/cx5r.pdf; componentlink2description: DigiKey Link; componentlink2url: http://digikey.com/product-detail/en/avx-corporation/0402ZD106MAT2A/478-10052-1-ND/6564275; Device Package: 0402 (1005 Metric); lastupdated: 2/8/2022 12:26:50 PM; Lifecycle Status: Active; Minimum Order: 1; Mounting Type: Surface Mount, MLCC; Operating Temperature: -55°C ~ 85°C; Package / Case: 0402 (1005 Metric); packaging: TapeAndReel; partid: 6854; Part Status: Active; price: 0.24; series: -; Size / Dimension: 0.039" L x 0.020" W (1.00mm x 0.50mm); Supplier 1: DigiKey; Supplier Part Number 1: 478-10052-1-ND; Temperature Coefficient: X5R; Thickness (Max): 0.028" (0.71mm); value: 10µF; Voltage - Rated: 10V
C24 = 0402BW105K160NGT: CAP CER 1UF 16V X5R 0402; manufacturer: Knowles Novacap; Tolerance: ±10%; Part Number: 0402BW105K160NGT; Capacitance: 1 µF; Applications: General Purpose; componentlink1description: Datasheet; componentlink1url: https://www.knowlescapacitors.com/getattachment/6c8d48ef-fc2b-4752-ae2c-ce6c208de0c4/High-Capacitance-Chip.aspx; componentlink2description: DigiKey Link; componentlink2url: https://www.digikey.com/en/products/detail/knowles-novacap/0402BW105K160NGT/7304075; Device Package: 0402 (1005 Metric); Features: Gold Flash Termination; lastupdated: 2/9/2024 8:04:33 PM; Lifecycle Status: Active; Minimum Order: 1; Mounting Type: Surface Mount, MLCC; Operating Temperature: -55°C ~ 85°C; Package / Case: 0402 (1005 Metric); packaging: TapeAndReel; partid: 4314; Part Status: Active; price: 1.00; series: -; Size / Dimension: 0.040" L x 0.020" W (1.02mm x 0.51mm); Supplier 1: DigiKey; Supplier Part Number 1: 1763-1163-1-ND; Temperature Coefficient: X5R; Thickness (Max): 0.024" (0.61mm); value: 1 µF; Voltage - Rated: 16V
C43 = 06036D476MAT2A: CAP CER 47UF 6.3V X5R 0603; manufacturer: AVX Corporation; Tolerance: ±20%; Part Number: 06036D476MAT2A; Capacitance: 47µF; Applications: General Purpose; componentlink1description: Datasheet; componentlink1url: http://datasheets.avx.com/cx5r.pdf; componentlink2description: DigiKey Link; componentlink2url: http://digikey.com/product-detail/en/avx-corporation/06036D476MAT2A/478-11180-1-ND/7563130; Device Package: 0603 (1608 Metric); lastupdated: 9/2/2020 1:03:20 AM; Lifecycle Status: Active; Minimum Order: 1; Mounting Type: Surface Mount, MLCC; Operating Temperature: -55°C ~ 85°C; Package / Case: 0603 (1608 Metric); packaging: TapeAndReel; partid: 11014; Part Status: Active; price: 0.41; series: -; Size / Dimension: 0.063" L x 0.031" W (1.60mm x 0.80mm); Supplier 1: DigiKey; Supplier Part Number 1: 478-11180-1-ND; Temperature Coefficient: X5R; value: 47µF; Voltage - Rated: 6.3V
C53 C54 C63 = CMP-714-000035-1: CAP CER 4.7UF; ComponentLink2Description: DigiKey Link; ComponentLink1Description: Datasheet
C64 = 0402B104J160CT: CAP CER 0.1UF 16V X7R 0402; manufacturer: Walsin Technology Corporation; Tolerance: ±5%; Part Number: 0402B104J160CT; Capacitance: 0.1 µF; Applications: General Purpose; componentlink1description: Datasheet; componentlink1url: http://www.passivecomponent.com/wp-content/uploads/2018/10/MLCC.pdf; componentlink2description: DigiKey Link; componentlink2url: https://www.digikey.com/en/products/detail/walsin-technology-corporation/0402B104J160CT/9354672; Device Package: 0402 (1005 Metric); lastupdated: 2/9/2024 8:04:31 PM; Lifecycle Status: Active; Minimum Order: 1; Mounting Type: Surface Mount, MLCC; Operating Temperature: -55°C ~ 125°C; Package / Case: 0402 (1005 Metric); packaging: TapeAndReel; partid: 41146; Part Status: Active; price: 0.01; series: -; Size / Dimension: 0.039" L x 0.020" W (1.00mm x 0.50mm); Supplier 1: DigiKey; Supplier Part Number 1: 1292-1174-1-ND; Temperature Coefficient: X7R; Thickness (Max): 0.022" (0.55mm); value: 0.1 µF; Voltage - Rated: 16V
C65 C73 = 0402N360J500CT: CAP CER 36PF 50V C0G/NP0 0402; manufacturer: Walsin Technology Corporation; Temperature Coefficient: C0G, NP0; Tolerance: ±5%; Part Number: 0402N360J500CT; Capacitance: 36 pF; Applications: General Purpose; componentlink1description: Datasheet; componentlink1url: http://www.passivecomponent.com/wp-content/uploads/2018/10/MLCC.pdf; componentlink2description: DigiKey Link; componentlink2url: https://www.digikey.com/en/products/detail/walsin-technology-corporation/0402N360J500CT/9354806; Device Package: 0402 (1005 Metric); lastupdated: 2/9/2024 8:04:27 PM; Lifecycle Status: Active; Minimum Order: 1; Mounting Type: Surface Mount, MLCC; Operating Temperature: -55°C ~ 125°C; Package / Case: 0402 (1005 Metric); packaging: TapeAndReel; partid: 8193; Part Status: Active; price: 0.01; series: -; Size / Dimension: 0.039" L x 0.020" W (1.00mm x 0.50mm); Supplier 1: DigiKey; Supplier Part Number 1: 1292-1309-1-ND; Thickness (Max): 0.022" (0.55mm); value: 36 pF; Voltage - Rated: 50V
D2 = CMP-22017-000025-1: LED YELLOW CLEAR SMD; Dominant Wavelength: 597nm; Power Rating: 75mW; Number of LEDs: 1; Lens Style: Diffused; Forward Current: 30mA; Test Current: 20mA; Forward Voltage: 2.4V; Wavelength: 588nm; Viewing Angle: 130°; Lens Color: Colorless; Reverse Voltage: 5V; Luminous Intensity: 180mcd; Case Code (Imperial): 0603; Width: 0.8mm; Power Dissipation: 75mW; Length: 1.6mm; Illumination Color: Yellow; Number of Pins: 2; Case Code (Metric): 1608; Mount: Surface Mount; Number of Elements: 1; Height: 0.55mm; Lens Transparency: Clear; Depth: 0.8mm; Min Operating Temperature: -55°C; Case/Package: 0603; Radiation Hardening: No; Max Operating Temperature: 85°C; Package Quantity: 1; Packaging: Tape and Reel; Lead Free: Lead Free; Color: Yellow
D3 = CMP-2000-05198-4: NexarPartId: 549907; Forward Voltage: 2V; Viewing Angle: 130°; Lens Transparency: Clear; Power Rating: 75mW; Number of LEDs: 1; Luminous Intensity: 35mcd; Forward Current: 20mA; Dominant Wavelength: 571nm; Illumination Color: Green; Lens Color: Clear, Colorless; Reverse Voltage: 5V; Wavelength: 574nm; Number of Pins: 2; Packaging: Tape and Reel; Number of Elements: 1; Schedule B: 8541402000, 8541402000; Height: 550µm; Case/Package: 0603; Depth: 800µm; Max Operating Temperature: 85°C; RoHS: Compliant; Lens Style: Clear; Lead Free: Lead Free; Length: 1.6mm; Mount: Surface Mount; Test Current: 20mA; Width: 800µm; Case Code (Imperial): 0603; Min Operating Temperature: -55°C; Case Code (Metric): 1608; Radiation Hardening: No; Power Dissipation: 75mW; Color: Green
D4 = CMP-1674-00011-2: LED RED CLEAR CHIP SMD; Reverse Voltage: 5V; Viewing Angle: 130°; Power Rating: 75mW; Test Current: 20mA; Number of Elements: 1; Lens Color: Colorless; Wavelength: 639nm; Dominant Wavelength: 631nm; Lens Style: Diffused; Forward Current: 30mA; Forward Voltage: 2.4V; Luminous Intensity: 54mcd; Color: Red; Case Code (Imperial): 0603; Lens Transparency: Clear; Lead Free: Lead Free; Package Quantity: 1; Packaging: Tape and Reel; Max Operating Temperature: 85°C; Number of Pins: 2; Height: 0.8mm; Case/Package: 0603; Number of LEDs: 1; Width: 0.8mm; Case Code (Metric): 1608; Depth: 0.8mm; Mount: Surface Mount; Radiation Hardening: No; Length: 1.6mm; Illumination Color: Red; Power Dissipation: 75mW; Min Operating Temperature: -55°C
FB1-FB6 = MHF1608BAC352ATD25: FERRITE BEAD 1.6K OHM 0603 1LN; Manufacturer: TDK Corporation; Current Rating (Max): 170mA; DC Resistance (DCR) (Max): 1.8Ohm; Number of Lines: 1; Part Number: MHF1608BAC352ATD25; ComponentLink1Description: Datasheet; ComponentLink1URL: https://media.digikey.com/pdf/Data%20Sheets/TDK%20PDFs/MHF1608_Type_DS.pdf; ComponentLink2Description: DigiKey Link; ComponentLink2URL: https://www.digikey.com/en/products/detail/tdk-corporation/MHF1608BAC352ATD25/12702586; Device Package: 0603 (1608 Metric); Height (Max): 0.037" (0.95mm); Impedance @ Frequency: 1.6 kOhms @ 100 MHz; LastUpdated: 6/3/2024 7:51:46 PM; Lifecycle Status: Active; Minimum Order: 1; Mounting Type: Surface Mount; Operating Temperature: -55°C ~ 125°C; Package / Case: 0603 (1608 Metric); Packaging: TapeAndReel; PartId: 2238; Part Status: Active; Price: 0.05; Ratings: AEC-Q200; Series: MHF; Size / Dimension: 0.063" L x 0.031" W (1.60mm x 0.80mm); Supplier 1: DigiKey; Supplier Part Number 1: 445-MHF1608BAC352ATD25CT-ND; Value: 1.6 kOhms @ 100 MHz
IC2 = F28P650DK9NMRR: Integrated Circuit; Manufacturer_Name: Texas Instruments; Datasheet Link: https://www.ti.com/lit/ds/symlink/tms320f28p650dk.pdf?ts=1743172224818&ref_url=https%253A%252F%252Fwww.ti.com%252Fproduct%252FTMS320F28P650DK%252Fpart-details%252FXF28P650DK9PTP; Height: 1mm; Manufacturer_Part_Number: F28P650DK9NMRR; Mouser Part Number: 595-F28P650DK9NMRR; Mouser Price/Stock: https://www.mouser.co.uk/ProductDetail/Texas-Instruments/F28P650DK9NMRR?qs=ZcfC38r4PouP1IzeuqZ7kg%3D%3D; Arrow Part Number: F28P650DK9NMRR; Arrow Price/Stock: https://www.arrow.com/en/products/f28p650dk9nmrr/texas-instruments?utm_currency=USD&region=nac
R9 = RR0510P-222-D: RES SMD 2.2K OHM 0.5% 1/16W 0402; Manufacturer: Susumu; Power (Watts): 0.063W, 1/16W; Temperature Coefficient: ±25ppm/°C; Part Number: RR0510P-222-D; Value: 2.2 kOhms; ComponentLink1Description: Datasheet; ComponentLink1URL: http://www.susumu.co.jp/common/pdf/n_catalog_partition05_en.pdf; ComponentLink2Description: DigiKey Link; ComponentLink2URL: https://www.digikey.com/en/products/detail/susumu/RR0510P-222-D/432405; Composition: Thin Film; Device Package: 0402 (1005 Metric); Height - Seated (Max): 0.016" (0.40mm); LastUpdated: 2/9/2024 8:30:21 PM; Lifecycle Status: Active; Minimum Order: 1; Number of Terminations: 2; Operating Temperature: -55°C ~ 125°C; Package / Case: 0402 (1005 Metric); Packaging: TapeAndReel; PartId: 3229; Part Status: Active; Price: 0.01; Resistance: 2.2 kOhms; Series: RR; Size / Dimension: 0.039" L x 0.020" W (1.00mm x 0.50mm); Supplier 1: DigiKey; Supplier Part Number 1: RR05P2.2KDCT-ND; Tolerance: ±0.5%
R10 R11 R50-R53 = RQ73C1E140RBTD: RES 140 OHMS 0.1% 1/16W 0402; Manufacturer: TE Connectivity Passive Product; Power (Watts): 0.063W, 1/16W; Temperature Coefficient: ±10ppm/°C; Part Number: RQ73C1E140RBTD; Value: 140 Ohms; ComponentLink1Description: Datasheet; ComponentLink1URL: //media.digikey.com/pdf/Data%20Sheets/Tyco%20Electronics%20P%20B%20PDFs/RQ73-0618%20v2.pdf; ComponentLink2Description: DigiKey Link; ComponentLink2URL: https://www.digikey.com/en/products/detail/te-connectivity-passive-product/RQ73C1E140RBTD/9480200; Composition: Thin Film; Device Package: 0402 (1005 Metric); Features: Anti-Sulfur, Automotive AEC-Q200; Height - Seated (Max): 0.016" (0.40mm); LastUpdated: 2/9/2024 8:30:21 PM; Lifecycle Status: Active; Minimum Order: 1; Number of Terminations: 2; Operating Temperature: -55°C ~ 155°C; Package / Case: 0402 (1005 Metric); Packaging: TapeAndReel; PartId: 3032; Part Status: Active; Price: 0.27; Ratings: AEC-Q200; Resistance: 140 Ohms; Series: RQ73; Size / Dimension: 0.039" L x 0.020" W (1.00mm x 0.50mm); Supplier 1: DigiKey; Supplier Part Number 1: A140252CT-ND; Supplier Device Package: 0402; Tolerance: ±0.1%
S1 = SKRPABE010: Switch; Manufacturer_Name: ALPS Electric; Datasheet Link: https://tech.alpsalpine.com/e/products/detail/SKRPABE010/; Height: 2.5mm; Manufacturer_Part_Number: SKRPABE010; Mouser Part Number: 688-SKRPAB; Mouser Price/Stock: https://www.mouser.co.uk/ProductDetail/Alps-Alpine/SKRPABE010?qs=m0BA540hBPe1GpcSf%2FZ5Yw%3D%3D
U14 = CMP-0367-00265-2: Low Noise, Very Low Drift, Precision Voltage Reference, -40 to 125 degC, 8-pin MSOP (DGK), Green (RoHS & no Sb/Br); Manufacturer: Texas Instruments; VI(Min)(V): 3.2; SubFamily: Series Voltage Reference; Rating: Catalog; Iout/Iz(Max)(mA): 10; Temp Coeff(Max)(ppm/ degree C): 3; Iq(Max)(uA): 1000; Initial Accuracy @ 25/deg C(%): 0.05; VI(Max)(V): 18; ComponentLink3URL: http://www.ti.com/litv/pdf/mpds028d; PackageVersion: 4073329/E; ComponentLink1URL: http://www.ti.com/; ComponentLink3Description: Package Specification; PackageReference: DGK0008A; Code_JEDEC: MO-187; ComponentLink1Description: Manufacturer URL; PackageDescription: 8-Pin Thin Small Outline Package 3 x 3 mm Body ,0.65 mm Pitch; ComponentLink2URL: http://www.ti.com/general/docs/lit/getliterature.tsp?genericPartNumber=REF5030&fileType=pdf; VO(V): 3; PartNumber: REF5030IDGKR; Eco-Plan: Green (RoHS & no Sb/Br); DatasheetVersion: SBOS410E; Mounting Technology: Surface Mount; ComponentLink2Description: Datasheet
Y1 = FA-20H_25.0000MD30Y-C0: Crystal or Oscillator; Manufacturer_Name: Epson Timing; Manufacturer_Part_Number: FA-20H 25.0000MD30Y-C0; Datasheet Link: https://support.epson.biz/td/api/doc_check.php?dl=brief_FA-20H&lang=en; Height: 0.55mm; Mouser Part Number: 732-FA-20H25MD30Y-C0; Mouser Price/Stock: https://www.mouser.co.uk/ProductDetail/Epson-Timing/FA-20H-25.0000MD30Y-C0?qs=f9yNj16SXrILXPvNJZKsVQ%3D%3D; Arrow Part Number: FA-20H 25.0000MD30Y-C0; Arrow Price/Stock: https://www.arrow.com/en/products/fa-20h25.0000md30y-c0/epson-electronics-america

## Sheet JTAG.SchDoc
size A; SheetNumber: 5; SheetTotal: 15
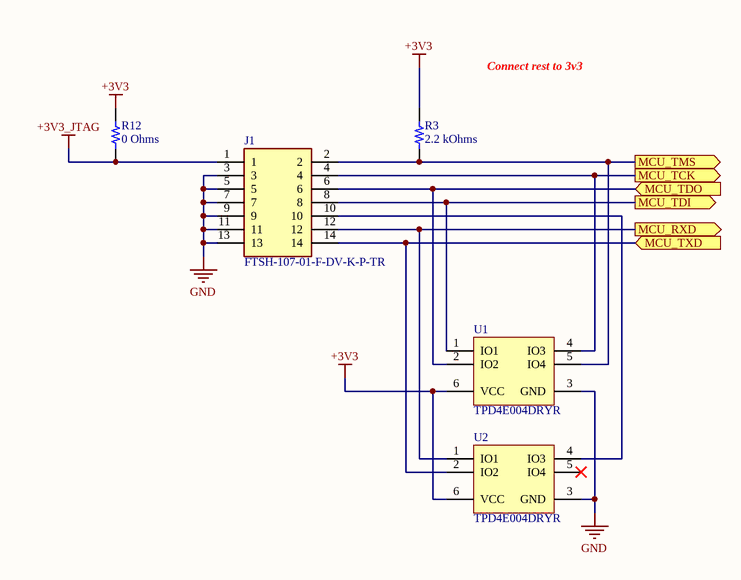
[diagram p3: JTAG.SchDoc]

### Parts
(Parts that share a designator on the sheet are numbered #1, #2 ... from top to bottom, then left to right.)
J1  FTSH-107-01-F-DV-K-P-TR  [FTSH-107-XX-YYY-DV-K-P-TR]
R3  2.2 kOhms  [RES 0402_1005]
R12#1  0 Ohms  [RES 0402_1005]
U1  TPD4E004DRYR  [DRY0006A]
U2  TPD4E004DRYR  [DRY0006A]

### Ports
MCU_RXD (out), MCU_TCK (out), MCU_TDI (out), MCU_TDO (in), MCU_TMS (out), MCU_TXD (in)

### Nets
+3V3: R3.2 R12#1.2 U1.6(VCC) U2.6(VCC)
+3V3_JTAG: J1.1 R12#1.1
GND: J1.3 J1.5 J1.7 J1.9 J1.11 J1.13 U1.3(GND) U2.3(GND)
MCU_RXD: J1.12 U2.1(IO1) ; port MCU_RXD
MCU_TCK: J1.4 U1.4(IO3) ; port MCU_TCK
MCU_TDI: J1.8 U1.1(IO1) ; port MCU_TDI
MCU_TDO: J1.6 U1.2(IO2) ; port MCU_TDO
MCU_TMS: J1.2 R3.1 U1.5(IO4) ; port MCU_TMS
MCU_TXD: J1.14 U2.2(IO2) ; port MCU_TXD
NetJ1_10: J1.10 U2.4(IO3)

Not connected (* = marked no-connect by the designer): U2 5(IO4)*

### Notes on the sheet
- Connect rest to 3v3

### Library data of the parts
J1 = FTSH-107-01-F-DV-K-P-TR: Connector; Manufacturer_Name: SAMTEC; Datasheet Link: http://suddendocs.samtec.com/prints/ftsh-1xx-xx-xxx-dv-xxx-xxx-mkt.pdf; Manufacturer_Part_Number: FTSH-107-01-F-DV-K-P-TR; Mouser Part Number: 200-FTSH10701FDVKPTR; Mouser Price/Stock: https://www.mouser.co.uk/ProductDetail/Samtec/FTSH-107-01-F-DV-K-P-TR?qs=%252BZP6%2F%252BtExtAI0atx6lcXTg%3D%3D; Arrow Part Number: FTSH-107-01-F-DV-K-P-TR; Arrow Price/Stock: https://www.arrow.com/en/products/ftsh-107-01-f-dv-k-p-tr/samtec?utm_currency=USD&region=nac
R3 = TNPW04022K20BYEP: RES 2.2K OHM 0.1% 1/16W 0402; Manufacturer: Vishay Dale; Power (Watts): 0.063W, 1/16W; Temperature Coefficient: ±10ppm/°C; Part Number: TNPW04022K20BYEP; Value: 2.2 kOhms; ComponentLink1Description: Datasheet; ComponentLink1URL: http://www.vishay.com/docs/28758/tnpw_e3.pdf; ComponentLink2Description: DigiKey Link; ComponentLink2URL: https://www.digikey.com/en/products/detail/vishay-dale/TNPW04022K20BYEP/8636618; Composition: Thin Film; Device Package: 0402 (1005 Metric); Features: Anti-Sulfur, Automotive AEC-Q200, Moisture Resistant; Height - Seated (Max): 0.016" (0.40mm); LastUpdated: 2/9/2024 8:30:21 PM; Lifecycle Status: Active; Minimum Order: 1; Number of Terminations: 2; Operating Temperature: -55°C ~ 155°C; Package / Case: 0402 (1005 Metric); Packaging: TapeAndReel; PartId: 3077; Part Status: Active; Price: 0.25; Ratings: AEC-Q200; Resistance: 2.2 kOhms; Series: TNPW e3; Size / Dimension: 0.039" L x 0.020" W (1.00mm x 0.50mm); Supplier 1: DigiKey; Supplier Part Number 1: 541-9805-1-ND; Supplier Device Package: 0402; Tolerance: ±0.1%
R12#1 = RCC04020000Z0ED: as R66 on sheet Schematic; Part Number: RCC04020000Z0ED; Value: 0 Ohms; ComponentLink1Description: Datasheet; ComponentLink1URL: https://www.vishay.com/docs/20066/rcce3.pdf; ComponentLink2Description: DigiKey Link; ComponentLink2URL: https://www.digikey.com/en/products/detail/vishay-dale/RCC04020000Z0ED/12084253; Composition: Thick Film; Device Package: 0402 (1005 Metric); Features: Automotive AEC-Q200; Height - Seated (Max): 0.016" (0.40mm); LastUpdated: 2/9/2024 8:28:54 PM; Lifecycle Status: Active; Minimum Order: 1; Number of Terminations: 2; Operating Temperature: -55°C ~ 155°C; Package / Case: 0402 (1005 Metric); Packaging: TapeAndReel; PartId: 66958; Part Status: Active; Price: 0.01; Ratings: AEC-Q200; Resistance: 0 Ohms; Series: RCC e3; Size / Dimension: 0.039" L x 0.020" W (1.00mm x 0.50mm); Supplier 1: DigiKey; Supplier Part Number 1: 541-RCC04020000Z0EDCT-ND; Supplier Device Package: 0402
U1 U2 = CMP-0326-00024-3: ESD-Protection Array for High-Speed Data Interfaces, 4 Channels, -40 to +85 degC, 6-pin SON (DRY), Green (RoHS & no Sb/Br); Manufacturer: Texas Instruments; USB High Speed: TRUE; IO Capacitance(Typ)(pF): 1.6; IEC 61000-4-2 Air-Gap(+/- kV): 12; SubFamily: ESD Solution; IO Leakage Current(nA): 1; Breakdown Voltage(Min)(V): 6; IEC 61000-4-2 Contact(+/- kV): 8; ComponentLink3Description: URL Link1; ComponentLink3URL: SamplesURL:http://www.ti.com/product/tpd4e004#samples; PackageReference: DRY0006A; ComponentLink2URL: http://www.ti.com/general/docs/lit/getliterature.tsp?genericPartNumber=TPD4E004&fileType=pdf; ComponentLink2Description: Datasheet; DatasheetVersion: SLVS729A; ComponentLink1Description: Manufacturer URL; PackageDescription: 6-Pin Plastic Small Outline No-Lead, 1 x 1.45 x 0.6 mm Body, 0.5 mm Pitch; 1394 / Firewire: TRUE; Serial ATA / eSATA: TRUE; Eco-Plan: Green (RoHS & no Sb/Br); ComponentLink1URL: http://www.ti.com/; PackageVersion: revF, Dec-2011; Mounting Technology: Surface Mount; PartNumber: TPD4E004DRYR